# EAGLE design attiny-breakout (EAGLE 8.3.2)
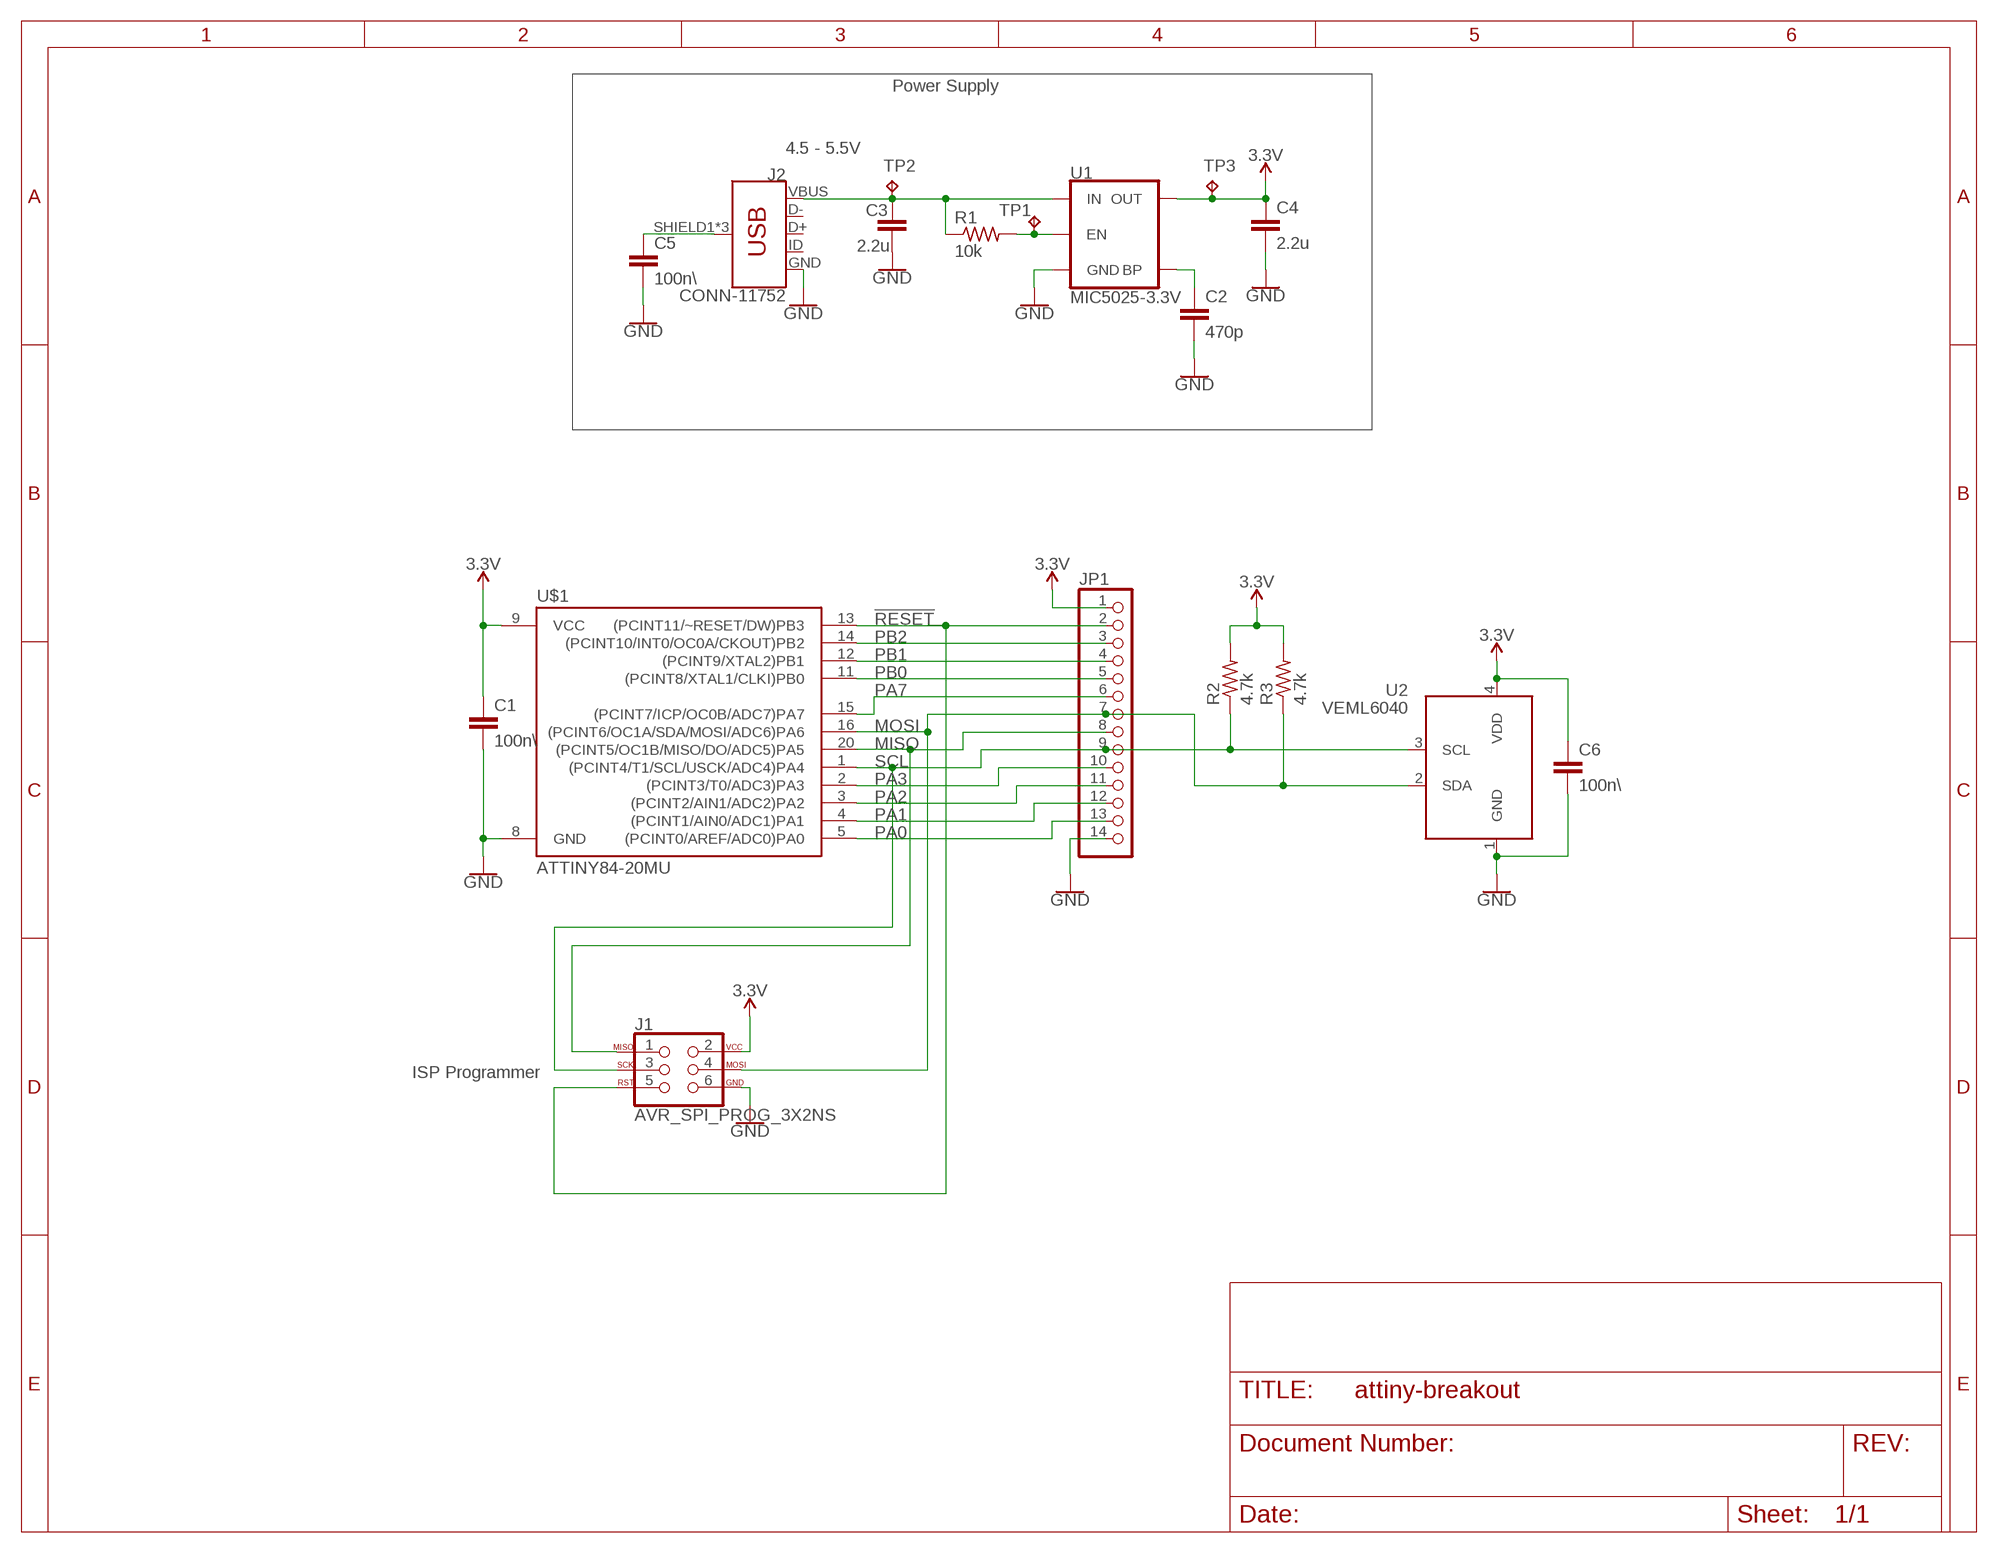
[diagram p0: schematic, sheet 1]

## Parts
C1  100n\  C-EUC0805  [C0805]
C2  470p  C-EUC0805  [C0805]
C3  2.2u  C-EUC0805  [C0805]
C4  2.2u  C-EUC0805  [C0805]
C5  100n\  C-EUC0805  [C0805]
C6  100n\  C-EUC0805  [C0805]
J1  AVR_SPI_PROG_3X2NS  [2X3-NS]
J2  CONN-11752  USB_MICRO-B_FEMALE-SMT  [USB-B-MICRO-SMD]
JP1  PINHD-1X14  [1X14]
R1  10k  R-US_R0805  [R0805]
R2  4.7k  R-US_R0805  [R0805]
R3  4.7k  R-US_R0805  [R0805]
TP1  TPPAD1-13  [P1-13]
TP2  TPPAD1-13  [P1-13]
TP3  TPPAD1-13  [P1-13]
U1  MIC5025-3.3V  V_REG_MIC52053.3V  [SOT23-5]
U2  VEML6040  [VEML6040]
U$1  ATTINY84-20MU  ATTINY84ATTINY84-20MU  [QFN20]

## Nets
3.3V: C1.1 C4.1 C6.1 J1.2 JP1.1 R2.2 R3.2 TP3.TP U1.5(OUT) U2.4(VDD) U$1.9(VCC)
!RESET: J1.5 JP1.2 U$1.13((PCINT11/~RESET/DW)PB3)
BP: C2.1 U1.4(BP)
EN: R1.2 TP1.TP U1.3(EN)
GND: C1.2 C2.2 C3.2 C4.2 C5.2 C6.2 J1.6 J2.GND JP1.14 U1.2(GND) U2.1(GND) U$1.8(GND)
MISO: J1.1 JP1.8 U$1.20((PCINT5/OC1B/MISO/DO/ADC5)PA5)
MOSI: J1.4 JP1.7 R3.1 U2.2(SDA) U$1.16((PCINT6/OC1A/SDA/MOSI/ADC6)PA6)
N$5: C5.1 J2.SHIELD1(SHIELD) J2.SHIELD2(SHIELD) J2.SHIELD3(SHIELD)
PA0: JP1.13 U$1.5((PCINT0/AREF/ADC0)PA0)
PA1: JP1.12 U$1.4((PCINT1/AIN0/ADC1)PA1)
PA2: JP1.11 U$1.3((PCINT2/AIN1/ADC2)PA2)
PA3: JP1.10 U$1.2((PCINT3/T0/ADC3)PA3)
PA7: JP1.6 U$1.15((PCINT7/ICP/OC0B/ADC7)PA7)
PB0: JP1.5 U$1.11((PCINT8/XTAL1/CLKI)PB0)
PB1: JP1.4 U$1.12((PCINT9/XTAL2)PB1)
PB2: JP1.3 U$1.14((PCINT10/INT0/OC0A/CKOUT)PB2)
SCL: J1.3 JP1.9 R2.1 U2.3(SCL) U$1.1((PCINT4/T1/SCL/USCK/ADC4)PA4)
VBUS: C3.1 J2.VBUS R1.1 TP2.TP U1.1(IN)
Unconnected: J2.D+ J2.D- J2.ID

## Notes on the sheet
- Power Supply
- 4.5 - 5.5V
- ISP Programmer

## Library data of the parts
C1-C6 = rcl:C-EU: CAPACITOR, European symbol
J1 = SparkFun-Connectors:AVR_SPI_PROG_3X2: AVR ISP 6 Pin This is the reduced ISP connector for AVR programming. Common on Arduino. This footprint will take up less PCB space and can be used with a 10-pin to 6-pin adapter such as SKU: BOB-08508 **Special note about "TEST_POINT" package. The stop mask is on the top side, so if you want your programming test points to be on the bottom of your board, make sure to place this package on the bottom side of the board. This also ensure that the orientation to program from the bottom side will be correct. SparkFun Products: SparkFun ISP Pogo Adapter <https://www.sparkfun.com/products/11591> - NS Tiny AVR Programmer <https://www.sparkfun.com/products/11801> -PTH
J2 = SparkFun-Connectors:USB_MICRO-B: USB Type Micro-B Connector Male/female and PTH/SMT variants SparkFun Products: SparkFun microB USB Breakout <https://www.sparkfun.com/products/12035> SparkFun USB microB Plug Breakout <https://www.sparkfun.com/products/10031> SparkFun ESP8266 Thing <https://www.sparkfun.com/products/13231>; PROD_ID: CONN-11752
JP1 = pinhead:PINHD-1X14: PIN HEADER
R1-R3 = rcl:R-US_: RESISTOR, American symbol
TP1-TP3 = testpad:TP: Test pad
U1 = SparkFun-IC-Power:V_REG_MIC5205: V_REG MIC5205 Standard 3.3V, 5V, and Adjustable 150mA LDO voltage regulator in SOT-23 layout. Micrel part MIC5205. BP (by-pass) pin is used to lower output noise with 470pF cap, may be left open. On the adjustable version BP is used to set output.; PROD_ID: VREG-00822; VALUE: 3.3V/150mA
U2 = color-sensors:VEML6040
U$1 = SparkFun-IC-Microcontroller:ATTINY84: Atmel 14-pin 2/4/8kB flash uC Datasheet <https://cdn.sparkfun.com/datasheets/Widgets/doc8006.pdf> SparkFun Products Tiny AVR Programmer <https://www.sparkfun.com/products/11801> (PGM-11801) SparkFun Servo Trigger - Continuous Rotation <https://www.sparkfun.com/products/13872> (WIG-13872) SparkFun Servo Trigger <https://www.sparkfun.com/products/13118> (WIG-13118)

## Board
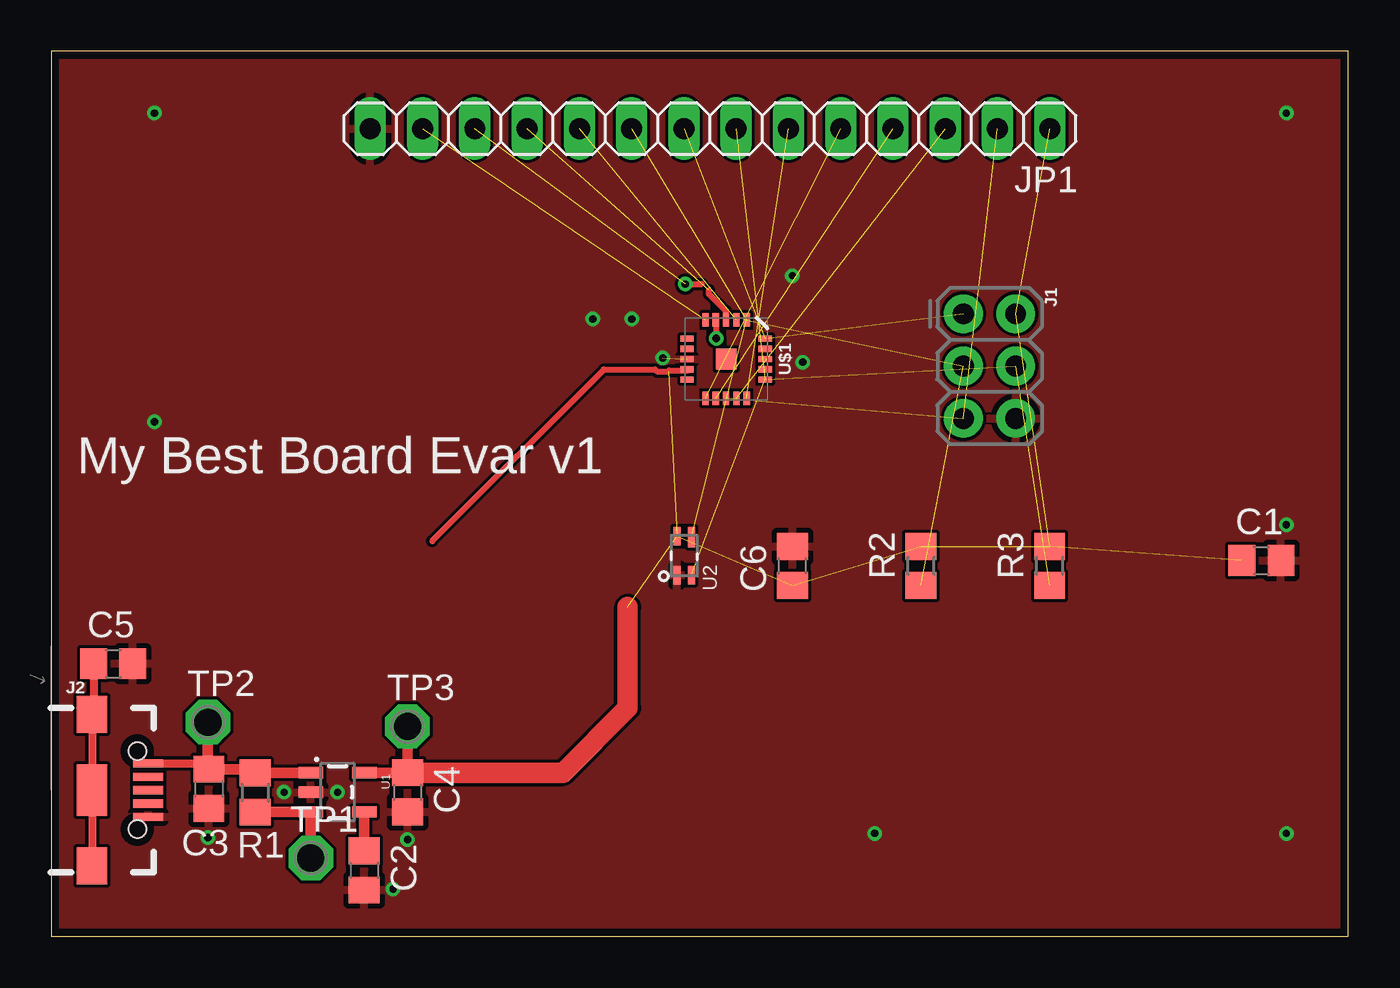
[diagram p1: board, top side]
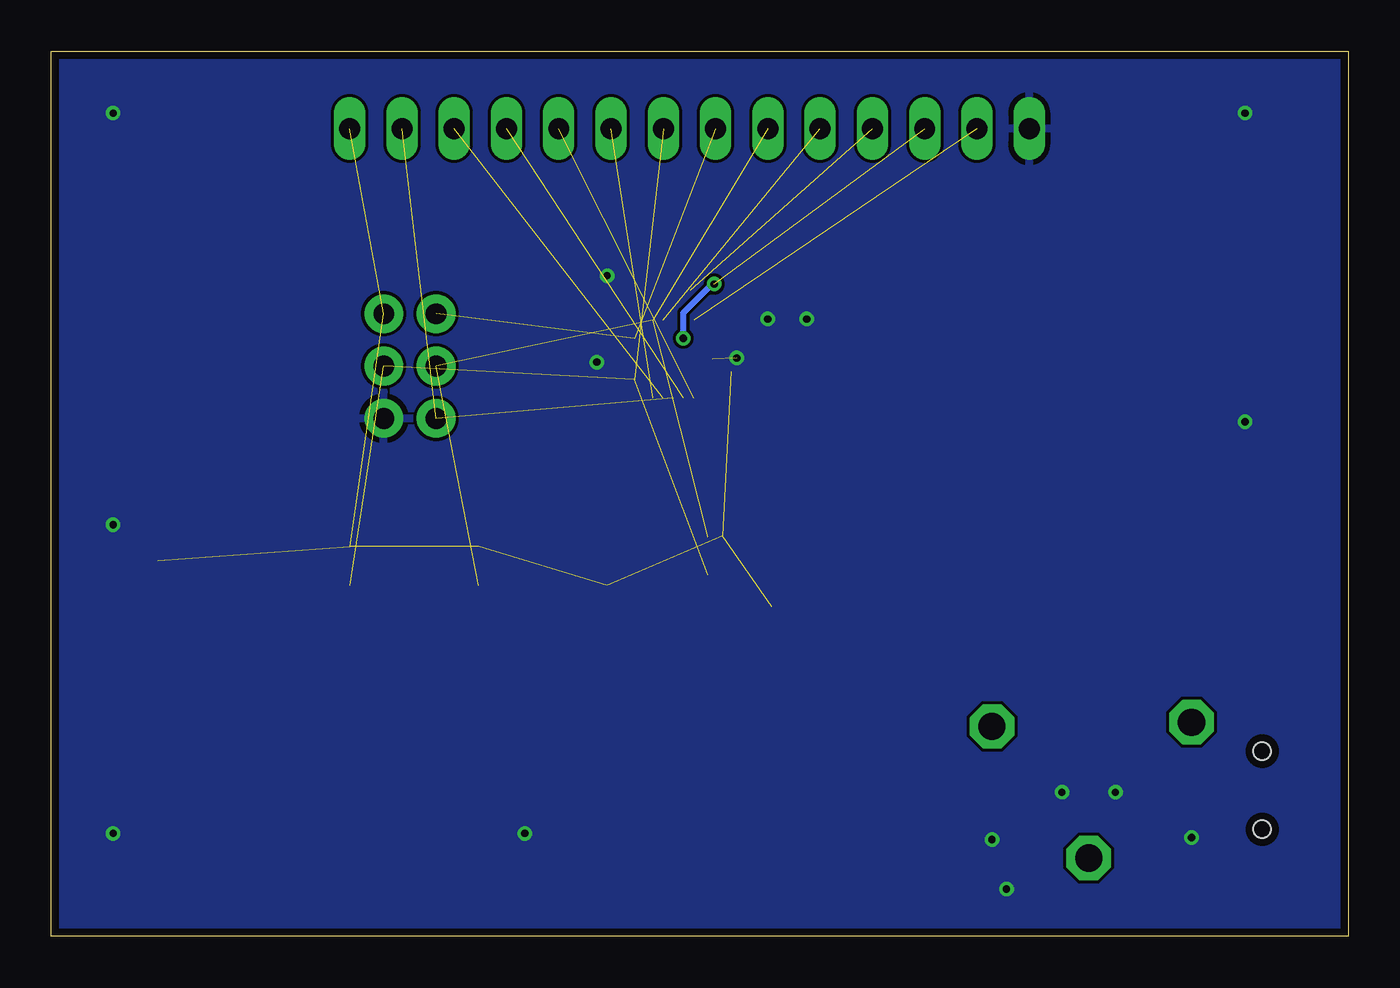
[diagram p2: board, bottom side, seen from below]

Size 63 x 43 mm. Coordinates in mm from the lower left corner, seen from the top.
Outline: 0,0 63,0 63,43 0,43 0,0
Copper layers (1*16): Top 0.0356mm / dielectric 1.5011mm / Bottom 0.0356mm
Design rules "osh-park-2-layers-design-rules": minimum track width 6mil, minimum drill 10mil, track to track 6mil, track to pad 6mil, pad to pad 6mil, via to via 6mil, smd to smd 6mil, copper to edge 15mil, drill to drill 6mil, minimum pad ring 7mil, minimum via ring 7mil, stop-mask expansion 3mil, vias tented up to drill 0mil, thermal gap 10mil

### Footprints (pad centres in the part's own frame; a part is rotated, then mirrored left to right if it is on the bottom)
C0805 = smd 1.3 x 1.5: 1 -0.95,0; 2 0.95,0
2X3-NS = drill 1.016 pad 1.88: 1 -2.54,-1.27; 2 -2.54,1.27; 3 0,-1.27; 4 0,1.27; 5 2.54,-1.27; 6 2.54,1.27
USB-B-MICRO-SMD = smd 1.45 x 0.4: D+ 2.725,0; D- 2.725,0.65; GND 2.725,-1.3; ID 2.725,-0.65; VBUS 2.725,1.3 | smd 1.5 x 1.8: SHIELD1 0,3.685; SHIELD2 0,-3.685 | smd 1.5 x 2.5: SHIELD3 0,0 | hole 0.85: 2.2,1.9; 2.2,-1.9
1X14 = drill 1.016 long: 1 -16.51,0; 2 -13.97,0; 3 -11.43,0; 4 -8.89,0; 5 -6.35,0; 6 -3.81,0; 7 -1.27,0; 8 1.27,0; 9 3.81,0; 10 6.35,0; 11 8.89,0; 12 11.43,0; 13 13.97,0; 14 16.51,0
R0805 = smd 1.3 x 1.5: 1 -0.95,0; 2 0.95,0
P1-13 = drill 1.321 pad 2.159 octagon: TP 0,0
SOT23-5 = smd 0.55 x 1.2: 1 -0.95,-1.3; 2 0,-1.3; 3 0.95,-1.3; 4 0.95,1.3; 5 -0.95,1.3
VEML6040 = smd 0.9 x 0.35: 1 -0.95,0.35; 2 -0.95,-0.35; 4 0.95,0.35 | smd 1 x 0.35: 3 0.9,-0.35
QFN20 = smd 1 x 1: 0 0,0 | smd 0.65 x 0.3: 1 -1.9,1; 2 -1.9,0.5; 3 -1.9,0; 4 -1.9,-0.5; 5 -1.9,-1; 11 1.9,-1; 12 1.9,-0.5; 13 1.9,0; 14 1.9,0.5; 15 1.9,1 | smd 0.3 x 0.65: 6 -1,-1.9; 7 -0.5,-1.9; 8 0,-1.9; 9 0.5,-1.9; 10 1,-1.9; 16 1,1.9; 17 0.5,1.9; 18 0,1.9; 19 -0.5,1.9; 20 -1,1.9

### Placement (x,y rotation side)
C1  58.79,18.26 0 top
C2  15.2,3.2 270 top
C3  7.65,7.17 270 top
C4  17.3,7 270 top
C5  3,13.25 0 top
C6  36,18 90 top
J1  45.58,27.71 270 top
J2  1.97,7.1 0 top
JP1  32,39.25 180 top
R1  9.9,6.99 270 top
R2  42.25,18 90 top
R3  48.5,18 90 top
TP1  12.6,3.8 0 top
TP2  7.6,10.4 0 top
TP3  17.3,10.2 0 top
U1  13.9,7 270 top
U2  30.75,18.5 90 top
U$1  32.78,28.05 270 top

### Tracks (layer width: path | path; a pad name or v marks a point on that pad's centre or on a via)
3.3V  (8 unrouted)
  Top 0.3: 18.5,19.2 26.85,27.55 29.33,27.55 29.43,27.45 29.97,27.45 30.03,27.5 30.93,27.5 | 31,27.5 30.93,27.5 | 30.93,27.5 U$1.9
  Top 0.4: U1.5 15.16,7.95
  Top 0.5: U1.5 C4.1 TP3.TP
  Top 1: C4.1 24.85,7.95 28,11.1 28,16
!RESET  (2 unrouted)
BP
  Top 0.4: C2.1
  Top 0.5: U1.4 C2.1
EN
  Top 0.4: 10,6.24 10,6.25 | 10,6.24 R1.2 | 10,6.24 10.01,6.25 10.21,6.05 | TP1.TP
  Top 0.5: 10.21,6.05 U1.3 TP1.TP
GND  (via drill 0.35)  (1 unrouted)
  other vias: 5,40 5,25 17.3,4.7 40,5 60,5 60,20 60,40 29.7,28.1 36.5,27.9 36,32.1 28.2,30 26.3,30 16.6,2.3 7.6,4.8 11.3,7 13.9,7
  pour Top: 0,0 0,43 63,43 63,0
  pour Bottom: 0,0 63,0 63,43 0,43
MISO  (2 unrouted)
MOSI  (4 unrouted)
N$5
  Top 0.152: J2.SHIELD1 1.97,10.75 2.05,10.83
  Top 0.4: J2.SHIELD2 J2.SHIELD3 1.97,10.75 | C5.1 2.05,10.83
PA0  (1 unrouted)
PA1  (via drill 0.35)  (1 unrouted)
  Top 0.3: U$1.4 32.28,29.32 32.3,29.3 v32.3,29.05 | v30.8,31.7 31.6,31.7
  Bottom 0.3: v32.3,29.05 32.3,30.3 30.9,31.7 v30.8,31.7
PA2  (1 unrouted)
  Top 0.3: U$1.3 32.78,30.38 31.95,31.21 31.95,31.4
PA3  (1 unrouted)
PA7  (1 unrouted)
PB0  (1 unrouted)
PB1  (1 unrouted)
PB2  (1 unrouted)
SCL  (4 unrouted)
VBUS
  Top 0.4: J2.VBUS 7.37,8.4 C3.1 7.6,8.17 | 9.82,8.12 R1.1
  Top 0.5: TP2.TP 7.6,8.17 | C3.1 9.82,8.12 9.99,7.95 U1.1

### Text on the board
tPlace: My Best Board Evar v1